# EAGLE schematic elasticNode (EAGLE 9.4.2)

## Sheet 1 of 4
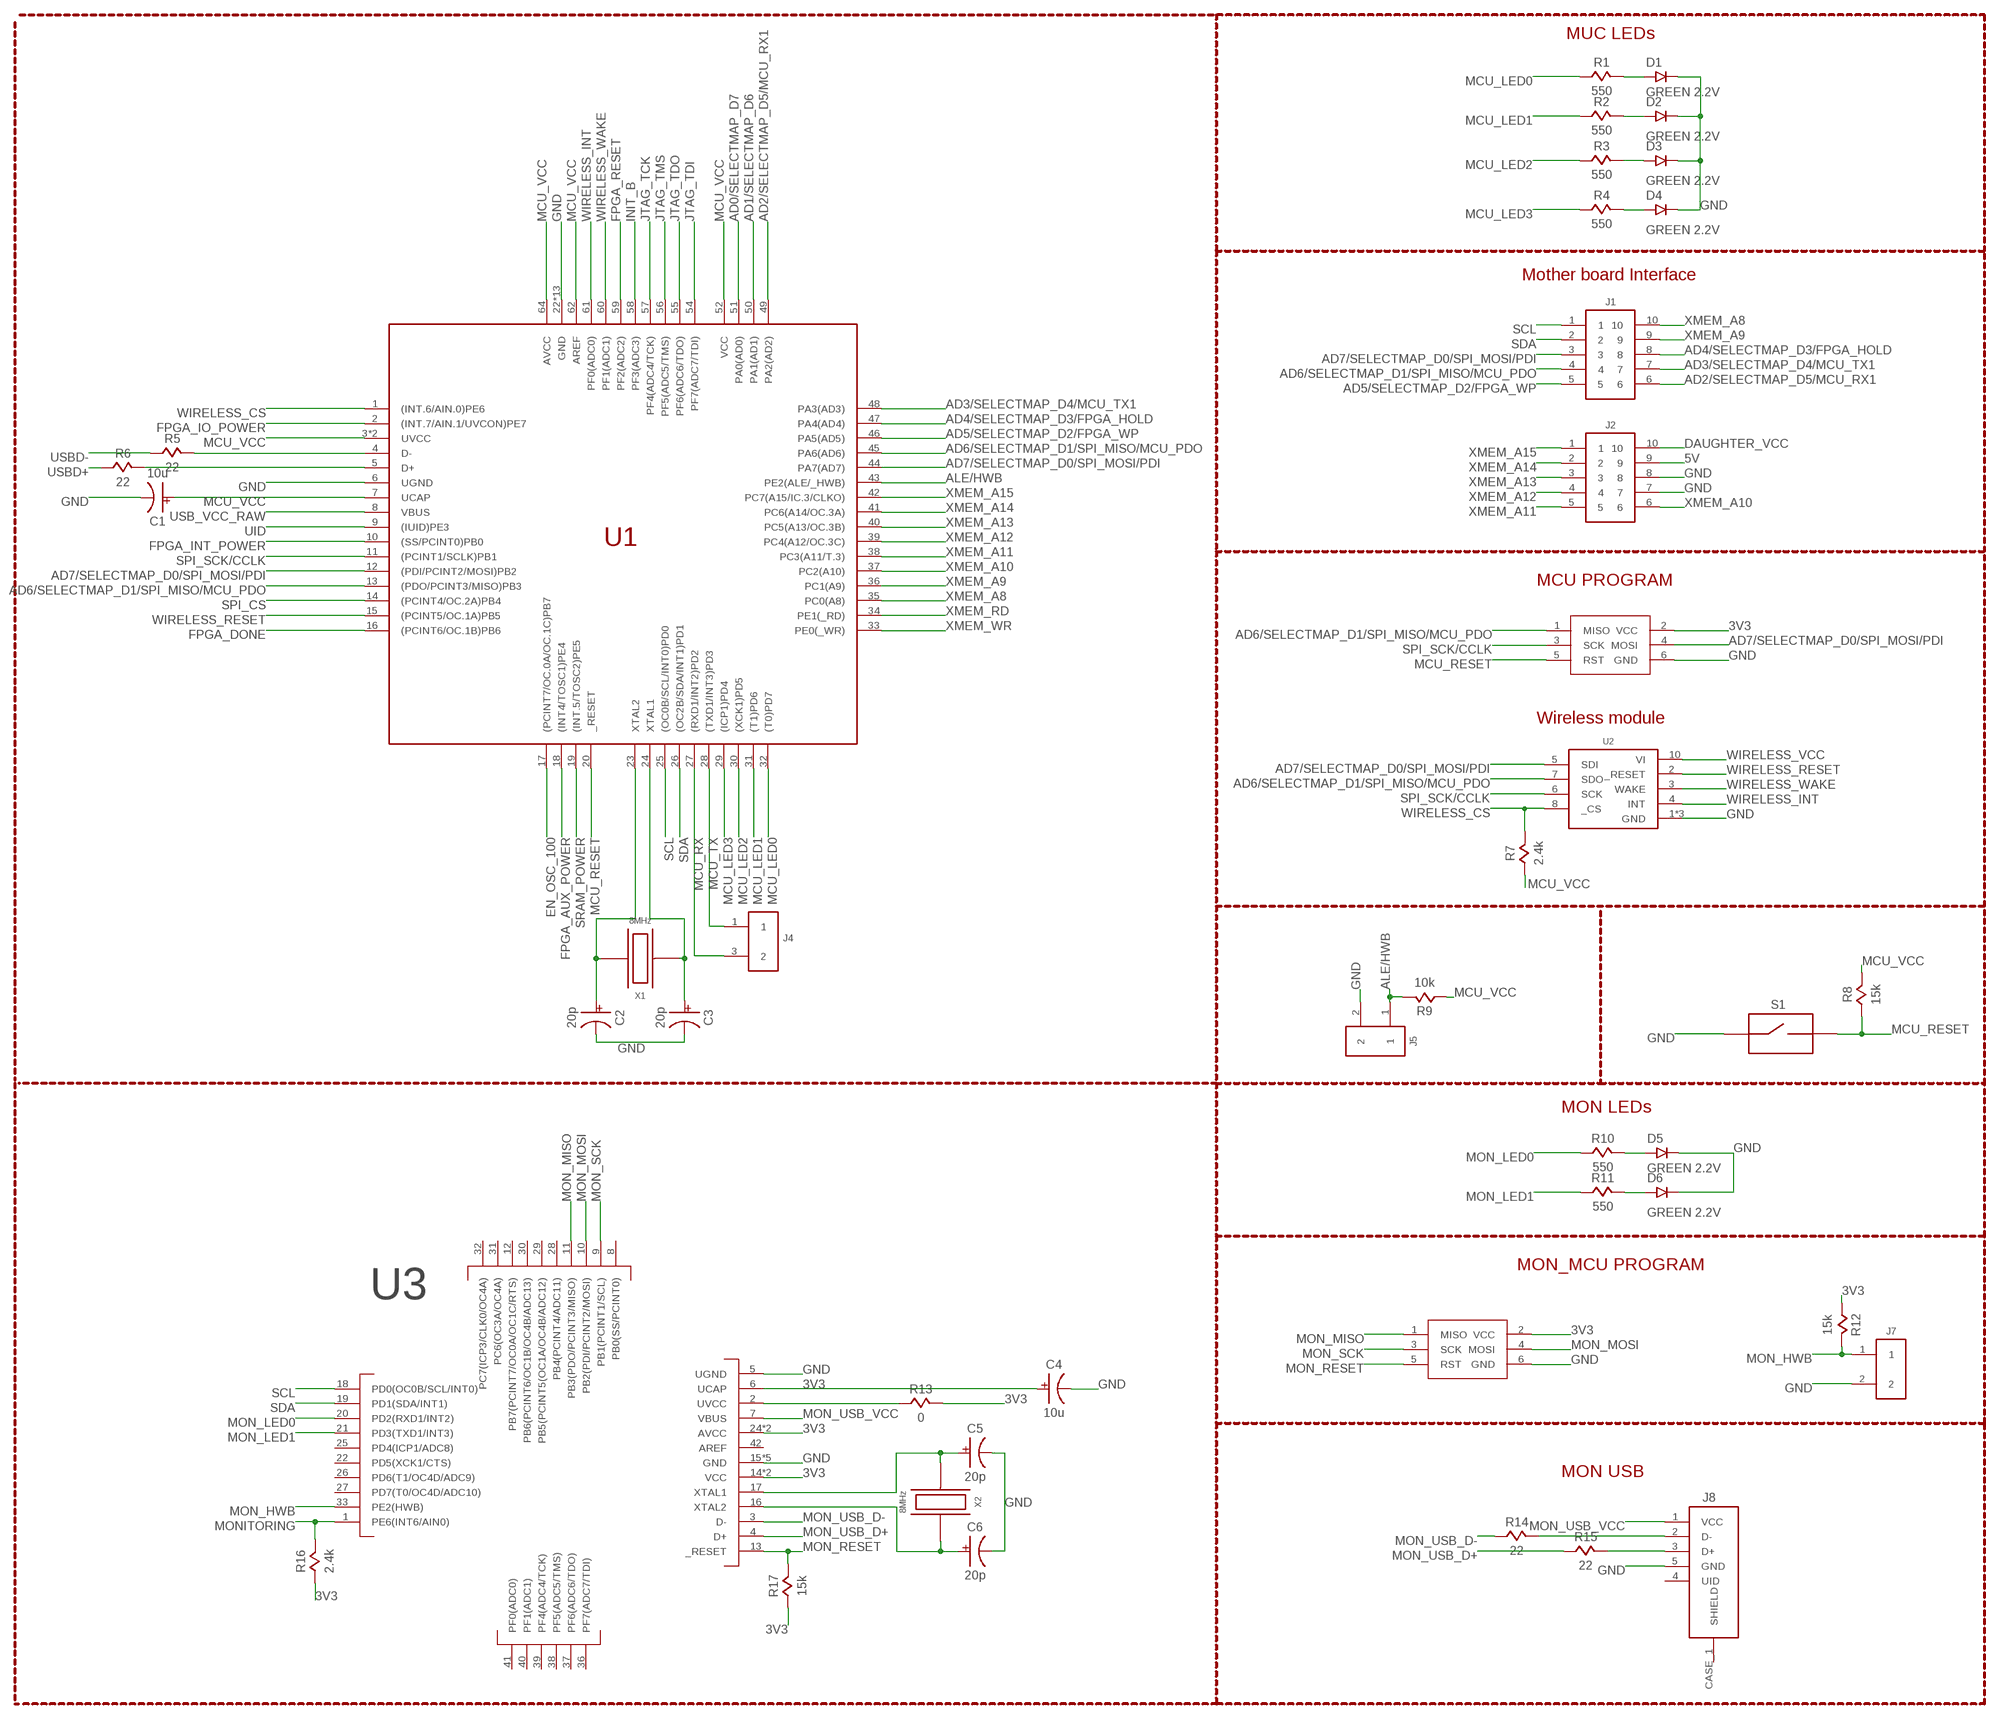
[diagram p0: schematic, sheet 1]

### Parts
C1  10u  CAPACITOR0805  [0805]
C2  20p  CAPACITOR0805  [0805]
C3  20p  CAPACITOR0805  [0805]
C4  10u  CAPACITOR0805  [0805]
C5  20p  CAPACITOR0805  [0805]
C6  20p  CAPACITOR0805  [0805]
D1  GREEN 2.2V  LED  [0805]
D2  GREEN 2.2V  LED  [0805]
D3  GREEN 2.2V  LED  [0805]
D4  GREEN 2.2V  LED  [0805]
D5  GREEN 2.2V  LED  [0805]
D6  GREEN 2.2V  LED  [0805]
J1  FEMALE_HEADER_5X2  [5X2_HEADER_SMT_1.27]
J2  FEMALE_HEADER_5X2  [5X2_HEADER_SMT_1.27]
J3  ISP_CONN_6PIN  [ICSP_SMT]
J4  FEMALE_HEADER_2X1  [2X1_HEADER]
J5  JUMPER  [JUMPER_SMT]
J6  ISP_CONN_6PIN  [ICSP_SMT]
J7  JUMPER  [JUMPER_SMT]
J8  USB_CONNMICRO_SMT  [USB_MICRO_B_SMT]
R1  550  RESISTOR  [0805]
R2  550  RESISTOR  [0805]
R3  550  RESISTOR  [0805]
R4  550  RESISTOR  [0805]
R5  22  RESISTOR  [0805]
R6  22  RESISTOR  [0805]
R7  2.4k  RESISTOR  [0805]
R8  15k  RESISTOR  [0805]
R9  10k  RESISTOR  [0805]
R10  550  RESISTOR  [0805]
R11  550  RESISTOR  [0805]
R12  15k  RESISTOR  [0805]
R13  0  RESISTOR  [0805]
R14  22  RESISTOR  [0805]
R15  22  RESISTOR  [0805]
R16  2.4k  RESISTOR  [0805]
R17  15k  RESISTOR  [0805]
S1  SPST_BUTTON2PIN_SMT  [SPST_2PIN_SMT]
U1  AT90USB128  [QFN64]
U2  MRF24J40MA  [MRF24J40MA]
U3  ATMEGA32U4QFN  [QFN44]
X1  8MHz  QUARTZ  [3.2X2.5_OSC]
X2  8MHz  QUARTZ  [3.2X2.5_OSC]

### Nets
3V3 [power]: C4.1 J3.2(VCC) J6.2(VCC) R12.1 R13.2 R16.1 R17.1 U3.6(UCAP) U3.14(VCC) U3.24(AVCC) U3.34(VCC) U3.44(AVCC) ; also sheet 2,3,4
5V [power]: J2.9 ; also sheet 3,4
AD0/SELECTMAP_D7: U1.51(PA0(AD0)) ; also sheet 2
AD1/SELECTMAP_D6: U1.50(PA1(AD1)) ; also sheet 2
AD2/SELECTMAP_D5/MCU_RX1: J1.6 U1.49(PA2(AD2)) ; also sheet 2
AD3/SELECTMAP_D4/MCU_TX1: J1.7 U1.48(PA3(AD3)) ; also sheet 2
AD4/SELECTMAP_D3/FPGA_HOLD: J1.8 U1.47(PA4(AD4)) ; also sheet 2
AD5/SELECTMAP_D2/FPGA_WP: J1.5 U1.46(PA5(AD5)) ; also sheet 2
AD6/SELECTMAP_D1/SPI_MISO/MCU_PDO: J1.4 J3.1(MISO) U1.13((PDO/PCINT3/MISO)PB3) U1.45(PA6(AD6)) U2.7(SDO) ; also sheet 2
AD7/SELECTMAP_D0/SPI_MOSI/PDI: J1.3 J3.4(MOSI) U1.12((PDI/PCINT2/MOSI)PB2) U1.44(PA7(AD7)) U2.5(SDI) ; also sheet 2
ALE/HWB: J5.1 R9.2 U1.43(PE2(ALE/_HWB)) ; also sheet 2
DAUGHTER_VCC [power]: J2.10 ; also sheet 3
EN_OSC_100 [power]: U1.17((PCINT7/OC.0A/OC.1C)PB7) ; also sheet 2
FPGA_AUX_POWER: U1.18((INT4/TOSC1)PE4) ; also sheet 2
FPGA_DONE: U1.16((PCINT6/OC.1B)PB6) ; also sheet 2
FPGA_INT_POWER: U1.10((SS/PCINT0)PB0) ; also sheet 2
FPGA_IO_POWER: U1.2((INT.7/AIN.1/UVCON)PE7) ; also sheet 2
FPGA_RESET: U1.59(PF2(ADC2)) ; also sheet 2
GND: C1.2 C2.2 C3.2 C4.2 C5.2 C6.2 D1.2 D2.2 D3.2 D4.2 D5.2 D6.2 J2.7 J2.8 J3.6(GND) J5.2 J6.6(GND) J7.2 J8.5(GND) S1.1 U1.6(UGND) U1.22(GND) U1.53(GND) U1.63(GND) U1.PAD(GND) U1.VIA1(GND) U1.VIA2(GND) U1.VIA3(GND) U1.VIA4(GND) U1.VIA5(GND) U1.VIA6(GND) U1.VIA7(GND) U1.VIA8(GND) U1.VIA9(GND) U2.1(GND) U2.11(GND) U2.12(GND) U3.5(UGND) U3.15(GND) U3.23(GND) U3.35(GND) U3.43(GND) U3.45(GND) ; also sheet 2,3,4
INIT_B: U1.58(PF3(ADC3)) ; also sheet 2
JTAG_TCK: U1.57(PF4(ADC4/TCK)) ; also sheet 2
JTAG_TDI: U1.54(PF7(ADC7/TDI)) ; also sheet 2
JTAG_TDO: U1.55(PF6(ADC6/TDO)) ; also sheet 2
JTAG_TMS: U1.56(PF5(ADC5/TMS)) ; also sheet 2
MCU_LED0: R1.1 U1.32((T0)PD7)
MCU_LED1: R2.1 U1.31((T1)PD6)
MCU_LED2: R3.1 U1.30((XCK1)PD5)
MCU_LED3: R4.1 U1.29((ICP1)PD4)
MCU_RESET: J3.5(RST) R8.1 S1.2 U1.20(_RESET)
MCU_RX: J4.3 U1.27((RXD1/INT2)PD2)
MCU_TX: J4.1 U1.28((TXD1/INT3)PD3)
MCU_VCC [power]: C1.1 R7.1 R8.2 R9.1 U1.3(UVCC) U1.7(UCAP) U1.21(UVCC) U1.52(VCC) U1.62(AREF) U1.64(AVCC) ; also sheet 3
MON_HWB: J7.1 R12.2 U3.33(PE2(HWB))
MON_LED0: R10.1 U3.20(PD2(RXD1/INT2))
MON_LED1: R11.1 U3.21(PD3(TXD1/INT3))
MON_MISO: J6.1(MISO) U3.11(PB3(PDO/PCINT3/MISO))
MON_MOSI: J6.4(MOSI) U3.10(PB2(PDI/PCINT2/MOSI))
MON_RESET: J6.5(RST) R17.2 U3.13(_RESET)
MON_SCK: J6.3(SCK) U3.9(PB1(PCINT1/SCL))
MON_USB_D+: R15.1 U3.4(D+)
MON_USB_D-: R14.1 U3.3(D-)
MON_USB_VCC [power]: J8.1(VCC) U3.7(VBUS)
MONITORING: R16.2 U3.1(PE6(INT6/AIN0)) ; also sheet 2
N$3: R5.2 U1.4(D-)
N$4: C2.1 U1.23(XTAL2) X1.1
N$5: J8.3(D+) R15.2
N$6: C3.1 U1.24(XTAL1) X1.3
N$10: R6.2 U1.5(D+)
N$13: D4.1 R4.2
N$15: D3.1 R3.2
N$16: D6.1 R11.2
N$17: D5.1 R10.2
N$18: C5.1 U3.17(XTAL1) X2.3
N$19: J8.2(D-) R14.2
N$20: C6.1 U3.16(XTAL2) X2.1
N$21: R13.1 U3.2(UVCC)
N$23: D2.1 R2.2
N$24: D1.1 R1.2
SCL: J1.1 U1.25((OC0B/SCL/INT0)PD0) U3.18(PD0(OC0B/SCL/INT0)) ; also sheet 3
SDA: J1.2 U1.26((OC2B/SDA/INT1)PD1) U3.19(PD1(SDA/INT1)) ; also sheet 3
SPI_CS: U1.14((PCINT4/OC.2A)PB4) ; also sheet 2
SPI_SCK/CCLK: J3.3(SCK) U1.11((PCINT1/SCLK)PB1) U2.6(SCK) ; also sheet 2
SRAM_POWER: U1.19((INT.5/TOSC2)PE5) ; also sheet 2
UID: U1.9((IUID)PE3) ; also sheet 4
USB_VCC_RAW [power]: U1.8(VBUS) ; also sheet 3,4
USBD+: R6.1 ; also sheet 4
USBD-: R5.1 ; also sheet 4
WIRELESS_CS: R7.2 U1.1((INT.6/AIN.0)PE6) U2.8(_CS)
WIRELESS_INT: U1.61(PF0(ADC0)) U2.4(INT)
WIRELESS_RESET: U1.15((PCINT5/OC.1A)PB5) U2.2(_RESET)
WIRELESS_VCC [power]: U2.10(VI) ; also sheet 3
WIRELESS_WAKE: U1.60(PF1(ADC1)) U2.3(WAKE)
XMEM_A8: J1.10 U1.35(PC0(A8)) ; also sheet 2
XMEM_A9: J1.9 U1.36(PC1(A9)) ; also sheet 2
XMEM_A10: J2.6 U1.37(PC2(A10)) ; also sheet 2
XMEM_A11: J2.5 U1.38(PC3(A11/T.3)) ; also sheet 2
XMEM_A12: J2.4 U1.39(PC4(A12/OC.3C)) ; also sheet 2
XMEM_A13: J2.3 U1.40(PC5(A13/OC.3B)) ; also sheet 2
XMEM_A14: J2.2 U1.41(PC6(A14/OC.3A)) ; also sheet 2
XMEM_A15: J2.1 U1.42(PC7(A15/IC.3/CLKO)) ; also sheet 2
XMEM_RD: U1.34(PE1(_RD)) ; also sheet 2
XMEM_WR: U1.33(PE0(_WR)) ; also sheet 2
Unconnected: J8.4(UID) J8.CASE_1(SHIELD) U3.8(PB0(SS/PCINT0)) U3.12(PB7(PCINT7/OC0A/OC1C/RTS)) U3.22(PD5(XCK1/CTS)) U3.25(PD4(ICP1/ADC8)) U3.26(PD6(T1/OC4D/ADC9)) U3.27(PD7(T0/OC4D/ADC10)) U3.28(PB4(PCINT4/ADC11)) U3.29(PB5(PCINT5(OC1A/OC4B/ADC12)) U3.30(PB6(PCINT6/OC1B/OC4B/ADC13)) U3.31(PC6(OC3A/OC4A)) U3.32(PC7(ICP3/CLK0/OC4A)) U3.36(PF7(ADC7/TDI)) U3.37(PF6(ADC6/TDO)) U3.38(PF5(ADC5/TMS)) U3.39(PF4(ADC4/TCK)) U3.40(PF1(ADC1)) U3.41(PF0(ADC0)) U3.42(AREF)

### Notes on the sheet
- MUC LEDs
- Mother board Interface
- MCU PROGRAM
- Wireless module
- MON LEDs
- MON_MCU PROGRAM
- MON USB

## Sheet 2 of 4
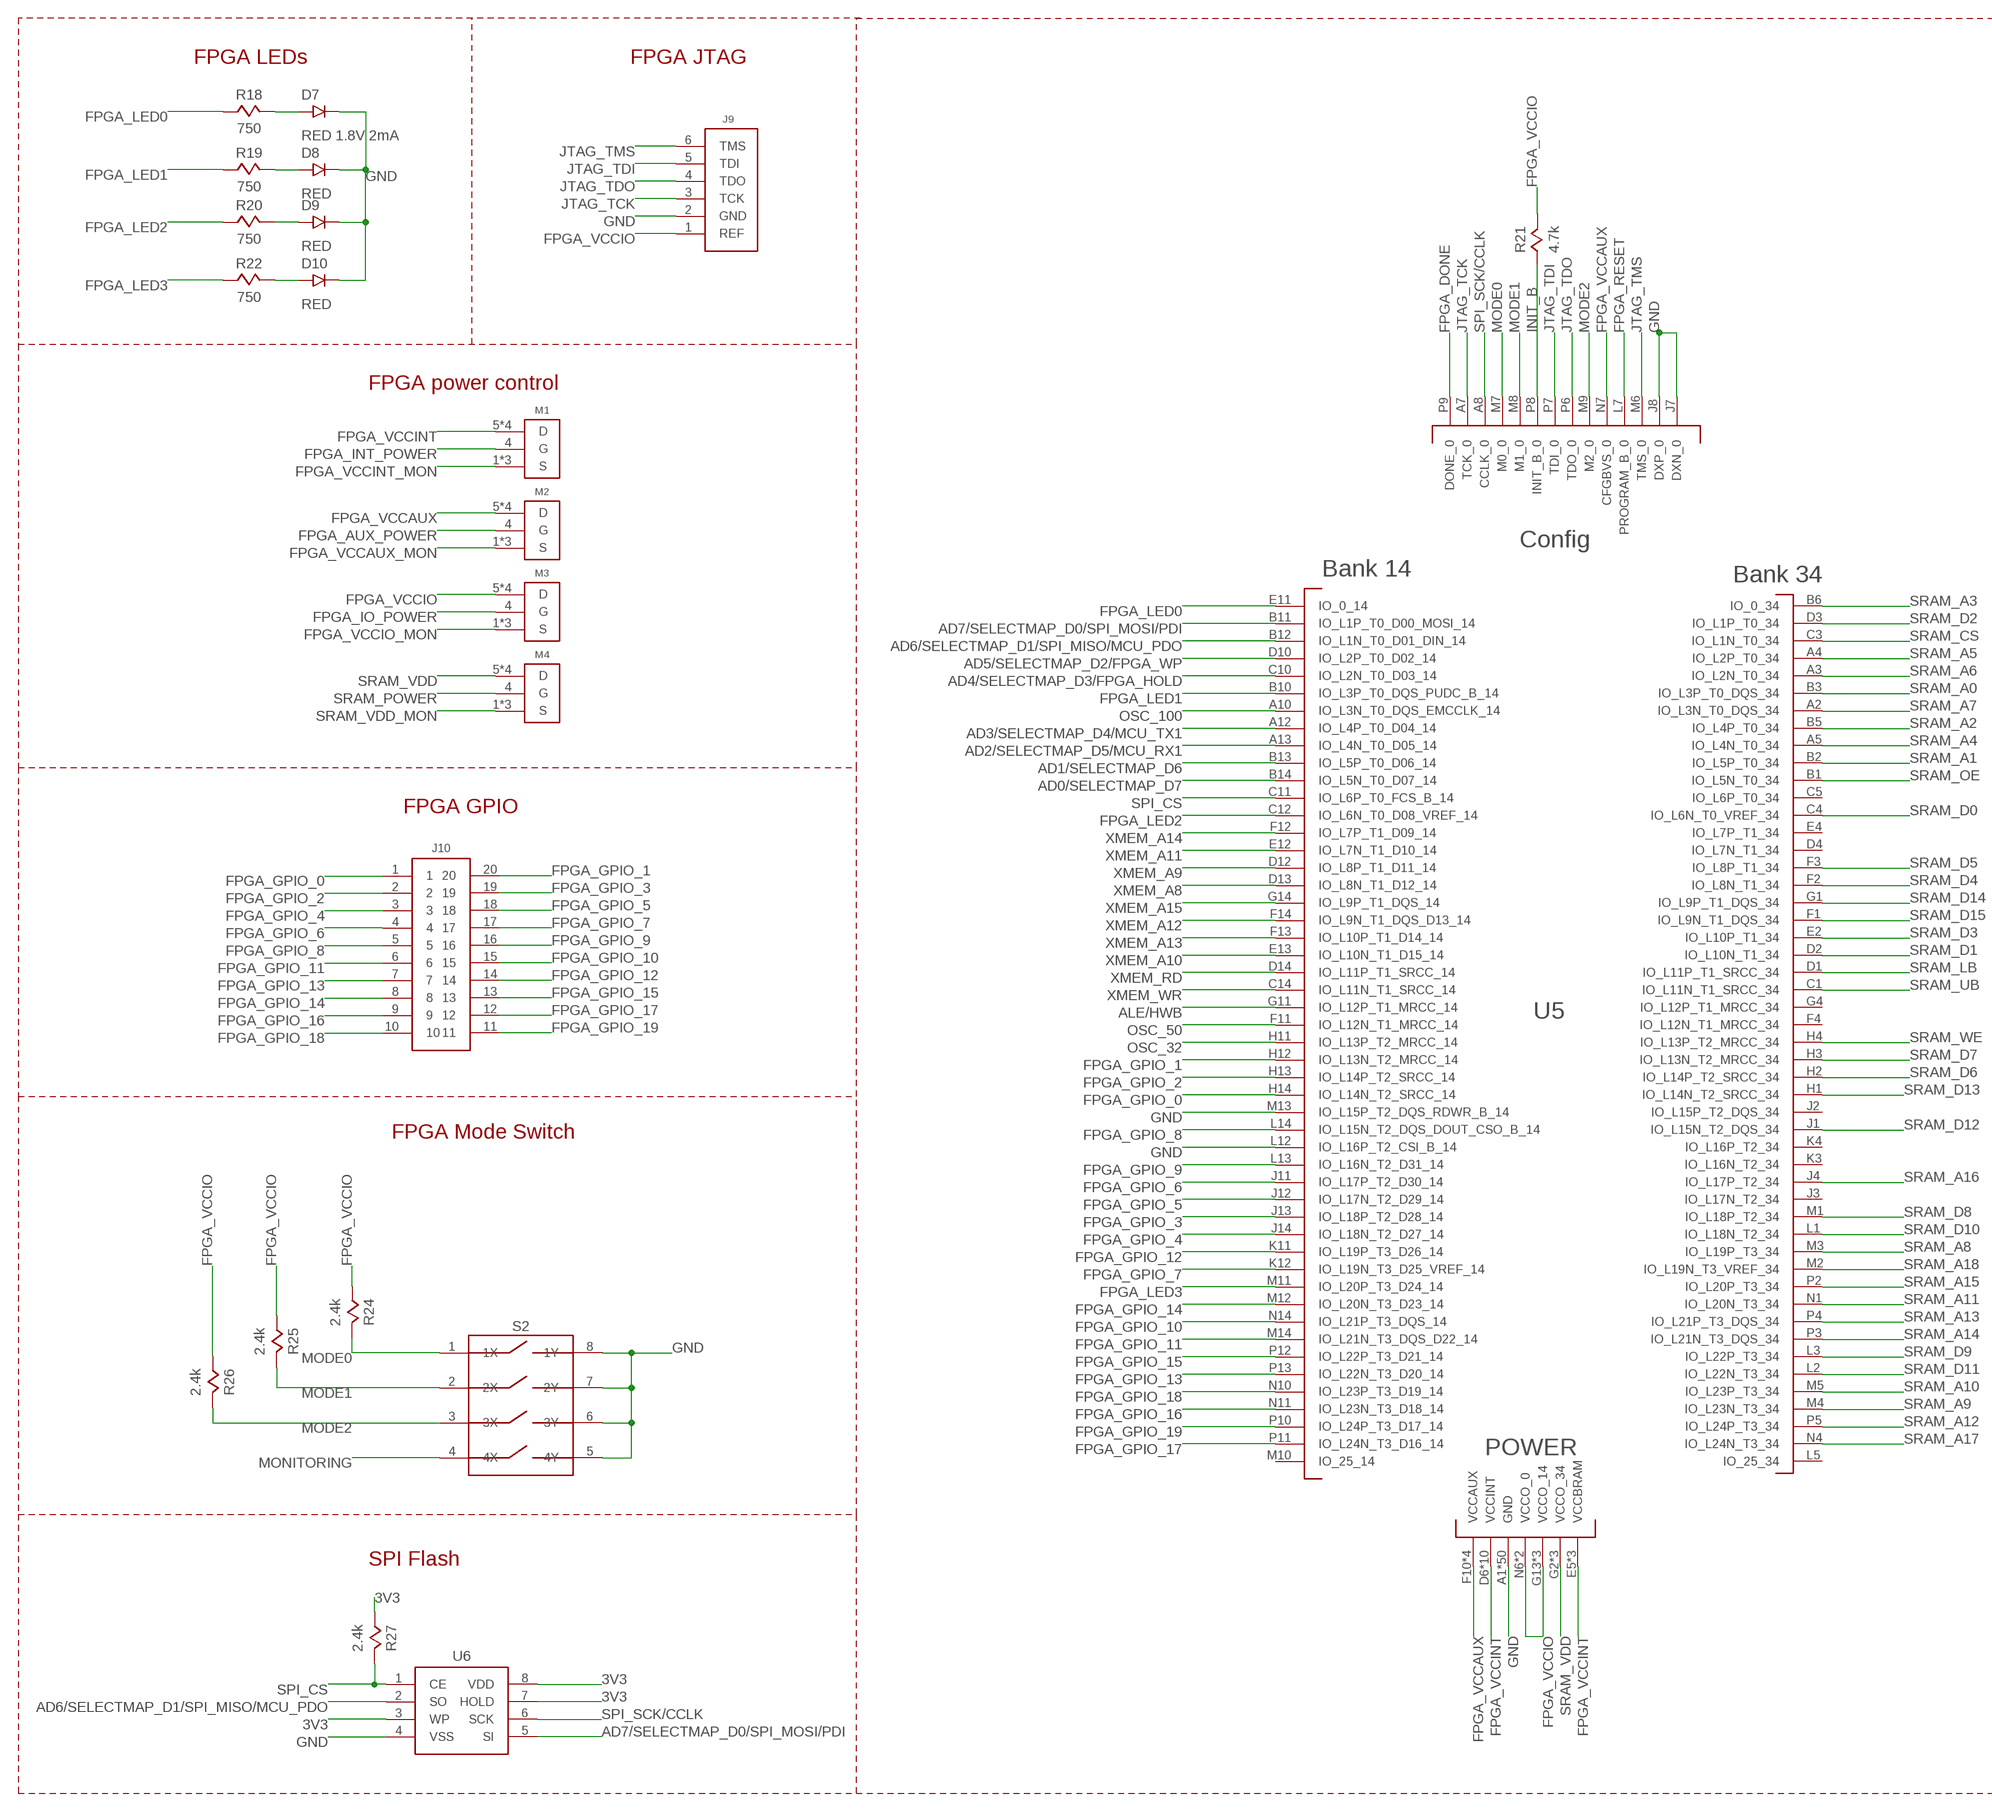
[diagram p1: schematic, sheet 2, part 1 of 2]
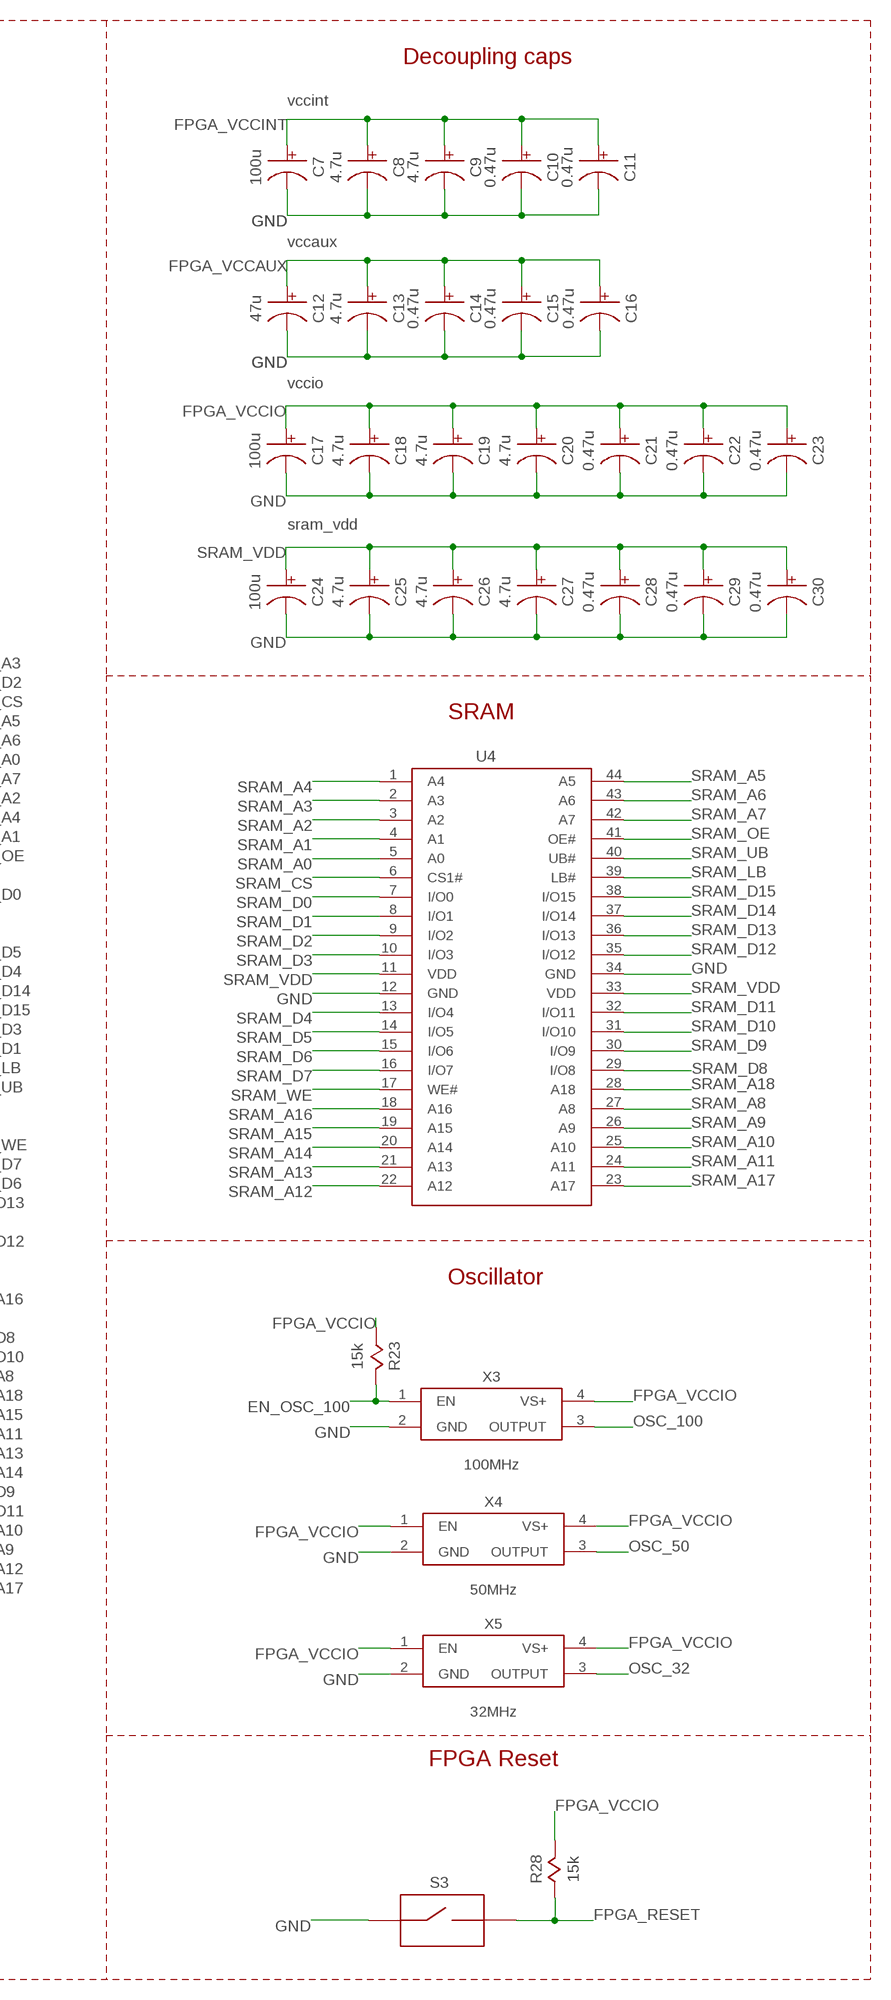
[diagram p2: schematic, sheet 2, part 2 of 2]

### Parts
C7  100u  CAPACITOR1210  [1210]
C8  4.7u  CAPACITOR0805  [0805]
C9  4.7u  CAPACITOR0805  [0805]
C10  0.47u  CAPACITOR0805  [0805]
C11  0.47u  CAPACITOR0805  [0805]
C12  47u  CAPACITOR1210  [1210]
C13  4.7u  CAPACITOR0805  [0805]
C14  0.47u  CAPACITOR0805  [0805]
C15  0.47u  CAPACITOR0805  [0805]
C16  0.47u  CAPACITOR0805  [0805]
C17  100u  CAPACITOR1210  [1210]
C18  4.7u  CAPACITOR0805  [0805]
C19  4.7u  CAPACITOR0805  [0805]
C20  4.7u  CAPACITOR0805  [0805]
C21  0.47u  CAPACITOR0805  [0805]
C22  0.47u  CAPACITOR0805  [0805]
C23  0.47u  CAPACITOR0805  [0805]
C24  100u  CAPACITOR1210  [1210]
C25  4.7u  CAPACITOR0805  [0805]
C26  4.7u  CAPACITOR0805  [0805]
C27  4.7u  CAPACITOR0805  [0805]
C28  0.47u  CAPACITOR0805  [0805]
C29  0.47u  CAPACITOR0805  [0805]
C30  0.47u  CAPACITOR0805  [0805]
D7  RED 1.8V 2mA  LED  [0805]
D8  RED  LED  [0805]
D9  RED  LED  [0805]
D10  RED  LED  [0805]
J9  JTAG_CONN_6PINSMT  [6X1_JTAG]
J10  FEMALE_HEADER_10X2  [10X2_HEADER_SMT]
M1  SISS23DN  [POWERPAK1212-8]
M2  SISS23DN  [POWERPAK1212-8]
M3  SISS23DN  [POWERPAK1212-8]
M4  SISS23DN  [POWERPAK1212-8]
R18  750  RESISTOR  [0805]
R19  750  RESISTOR  [0805]
R20  750  RESISTOR  [0805]
R21  4.7k  RESISTOR  [0805]
R22  750  RESISTOR  [0805]
R23  15k  RESISTOR  [0805]
R24  2.4k  RESISTOR  [0805]
R25  2.4k  RESISTOR  [0805]
R26  2.4k  RESISTOR  [0805]
R27  2.4k  RESISTOR  [0805]
R28  15k  RESISTOR  [0805]
S2  SPST_DIP_4  [SPST_DIP4_SMT]
S3  SPST_BUTTON2PIN_SMT  [SPST_2PIN_SMT]
U4  IS66WV51216EALL  [TSOP44]
U5  SPARTAN7-LX15  [FTGB196]
U6  SST26VF032BWDFN  [WDFN8]
X3  100MHz  OSCILLATOR3.2X2.5  [3.2X2.5_OSC]
X4  50MHz  OSCILLATOR3.2X2.5  [3.2X2.5_OSC]
X5  32MHz  OSCILLATOR3.2X2.5  [3.2X2.5_OSC]

### Nets
3V3 [power]: R27.1 U6.3(WP) U6.7(HOLD) U6.8(VDD) ; also sheet 1,3,4
AD0/SELECTMAP_D7: U5.B14(IO_L5N_T0_D07_14) ; also sheet 1
AD1/SELECTMAP_D6: U5.B13(IO_L5P_T0_D06_14) ; also sheet 1
AD2/SELECTMAP_D5/MCU_RX1: U5.A13(IO_L4N_T0_D05_14) ; also sheet 1
AD3/SELECTMAP_D4/MCU_TX1: U5.A12(IO_L4P_T0_D04_14) ; also sheet 1
AD4/SELECTMAP_D3/FPGA_HOLD: U5.C10(IO_L2N_T0_D03_14) ; also sheet 1
AD5/SELECTMAP_D2/FPGA_WP: U5.D10(IO_L2P_T0_D02_14) ; also sheet 1
AD6/SELECTMAP_D1/SPI_MISO/MCU_PDO: U5.B12(IO_L1N_T0_D01_DIN_14) U6.2(SO) ; also sheet 1
AD7/SELECTMAP_D0/SPI_MOSI/PDI: U5.B11(IO_L1P_T0_D00_MOSI_14) U6.5(SI) ; also sheet 1
ALE/HWB: U5.G11(IO_L12P_T1_MRCC_14) ; also sheet 1
EN_OSC_100 [power]: R23.1 X3.1(EN) ; also sheet 1
FPGA_AUX_POWER: M2.4(G) ; also sheet 1
FPGA_DONE: U5.P9(DONE_0) ; also sheet 1
FPGA_GPIO_0: J10.1 U5.H14(IO_L14N_T2_SRCC_14)
FPGA_GPIO_1: J10.20 U5.H12(IO_L13N_T2_MRCC_14)
FPGA_GPIO_2: J10.2 U5.H13(IO_L14P_T2_SRCC_14)
FPGA_GPIO_3: J10.19 U5.J13(IO_L18P_T2_D28_14)
FPGA_GPIO_4: J10.3 U5.J14(IO_L18N_T2_D27_14)
FPGA_GPIO_5: J10.18 U5.J12(IO_L17N_T2_D29_14)
FPGA_GPIO_6: J10.4 U5.J11(IO_L17P_T2_D30_14)
FPGA_GPIO_7: J10.17 U5.K12(IO_L19N_T3_D25_VREF_14)
FPGA_GPIO_8: J10.5 U5.L14(IO_L15N_T2_DQS_DOUT_CSO_B_14)
FPGA_GPIO_9: J10.16 U5.L13(IO_L16N_T2_D31_14)
FPGA_GPIO_10: J10.15 U5.N14(IO_L21P_T3_DQS_14)
FPGA_GPIO_11: J10.6 U5.M14(IO_L21N_T3_DQS_D22_14)
FPGA_GPIO_12: J10.14 U5.K11(IO_L19P_T3_D26_14)
FPGA_GPIO_13: J10.7 U5.P13(IO_L22N_T3_D20_14)
FPGA_GPIO_14: J10.8 U5.M12(IO_L20N_T3_D23_14)
FPGA_GPIO_15: J10.13 U5.P12(IO_L22P_T3_D21_14)
FPGA_GPIO_16: J10.9 U5.N11(IO_L23N_T3_D18_14)
FPGA_GPIO_17: J10.12 U5.P11(IO_L24N_T3_D16_14)
FPGA_GPIO_18: J10.10 U5.N10(IO_L23P_T3_D19_14)
FPGA_GPIO_19: J10.11 U5.P10(IO_L24P_T3_D17_14)
FPGA_INT_POWER: M1.4(G) ; also sheet 1
FPGA_IO_POWER: M3.4(G) ; also sheet 1
FPGA_LED0: R18.1 U5.E11(IO_0_14)
FPGA_LED1: R19.1 U5.B10(IO_L3P_T0_DQS_PUDC_B_14)
FPGA_LED2: R20.1 U5.C12(IO_L6N_T0_D08_VREF_14)
FPGA_LED3: R22.1 U5.M11(IO_L20P_T3_D24_14)
FPGA_RESET: R28.1 S3.2 U5.L7(PROGRAM_B_0) ; also sheet 1
FPGA_VCCAUX [power]: C12.1 C13.1 C14.1 C15.1 C16.1 M2.5(D) M2.6(D) M2.7(D) M2.8(D) U5.F10(VCCAUX) U5.H10(VCCAUX) U5.K10(VCCAUX) U5.L9(VCCAUX) U5.N7(CFGBVS_0)
FPGA_VCCAUX_MON [power]: M2.1(S) M2.2(S) M2.3(S) ; also sheet 3
FPGA_VCCINT [power]: C7.1 C8.1 C9.1 C10.1 C11.1 M1.5(D) M1.6(D) M1.7(D) M1.8(D) U5.D6(VCCINT) U5.D8(VCCINT) U5.E5(VCCBRAM) U5.E7(VCCINT) U5.E9(VCCINT) U5.F6(VCCINT) U5.G5(VCCBRAM) U5.G9(VCCINT) U5.H6(VCCINT) U5.J5(VCCBRAM) U5.J9(VCCINT) U5.K6(VCCINT) U5.K8(VCCINT)
FPGA_VCCINT_MON [power]: M1.1(S) M1.2(S) M1.3(S) ; also sheet 3
FPGA_VCCIO [power]: C17.1 C18.1 C19.1 C20.1 C21.1 C22.1 C23.1 J9.1(REF) M3.5(D) M3.6(D) M3.7(D) M3.8(D) R21.2 R23.2 R24.1 R25.1 R26.1 R28.2 U5.G13(VCCO_14) U5.K13(VCCO_14) U5.N6(VCCO_0) U5.N8(VCCO_0) U5.N13(VCCO_14) X3.4(VS+) X4.1(EN) X4.4(VS+) X5.1(EN) X5.4(VS+)
FPGA_VCCIO_MON [power]: M3.1(S) M3.2(S) M3.3(S) ; also sheet 3
GND: C7.2 C8.2 C9.2 C10.2 C11.2 C12.2 C13.2 C14.2 C15.2 C16.2 C17.2 C18.2 C19.2 C20.2 C21.2 C22.2 C23.2 C24.2 C25.2 C26.2 C27.2 C28.2 C29.2 C30.2 D7.2 D8.2 D9.2 D10.2 J9.2(GND) S2.5(4Y) S2.6(3Y) S2.7(2Y) S2.8(1Y) S3.1 U4.12(GND) U4.34(GND) U5.A1(GND) U5.A6(GND) U5.A9(GND) U5.A11(GND) U5.A14(GND) U5.B4(GND) U5.B7(GND) U5.B9(GND) U5.C2(GND) U5.C6(GND) U5.C7(GND) U5.C8(GND) U5.C9(GND) U5.C13(GND) U5.D5(GND) U5.D7(GND) U5.D9(GND) U5.D11(GND) U5.E1(GND) U5.E3(GND) U5.E6(GND) U5.E8(GND) U5.E10(GND) U5.E14(GND) U5.F5(GND) U5.F9(GND) U5.G3(GND) U5.G6(GND) U5.G10(GND) U5.G12(GND) U5.H5(GND) U5.H9(GND) U5.J6(GND) U5.J7(DXN_0) U5.J8(DXP_0) U5.J10(GND) U5.K1(GND) U5.K5(GND) U5.K7(GND) U5.K9(GND) U5.K14(GND) U5.L4(GND) U5.L6(GND) U5.L8(GND) U5.L10(GND) U5.L11(GND) U5.L12(IO_L16P_T2_CSI_B_14) U5.M13(IO_L15P_T2_DQS_RDWR_B_14) U5.N3(GND) U5.N5(GND) U5.N9(GND) U5.N12(GND) U5.P1(GND) U5.P14(GND) U6.4(VSS) X3.2(GND) X4.2(GND) X5.2(GND) ; also sheet 1,3,4
INIT_B: R21.1 U5.P8(INIT_B_0) ; also sheet 1
JTAG_TCK: J9.3(TCK) U5.A7(TCK_0) ; also sheet 1
JTAG_TDI: J9.5(TDI) U5.P7(TDI_0) ; also sheet 1
JTAG_TDO: J9.4(TDO) U5.P6(TDO_0) ; also sheet 1
JTAG_TMS: J9.6(TMS) U5.M6(TMS_0) ; also sheet 1
MODE0: R24.2 S2.1(1X) U5.M7(M0_0)
MODE1: R25.2 S2.2(2X) U5.M8(M1_0)
MODE2: R26.2 S2.3(3X) U5.M9(M2_0)
MONITORING: S2.4(4X) ; also sheet 1
N$25: D10.1 R22.2
N$27: D9.1 R20.2
N$29: D8.1 R19.2
N$30: D7.1 R18.2
OSC_32: U5.H11(IO_L13P_T2_MRCC_14) X5.3(OUTPUT)
OSC_50: U5.F11(IO_L12N_T1_MRCC_14) X4.3(OUTPUT)
OSC_100: U5.A10(IO_L3N_T0_DQS_EMCCLK_14) X3.3(OUTPUT)
SPI_CS: R27.2 U5.C11(IO_L6P_T0_FCS_B_14) U6.1(CE) ; also sheet 1
SPI_SCK/CCLK: U5.A8(CCLK_0) U6.6(SCK) ; also sheet 1
SRAM_A0: U4.5(A0) U5.B3(IO_L3P_T0_DQS_34)
SRAM_A1: U4.4(A1) U5.B2(IO_L5P_T0_34)
SRAM_A2: U4.3(A2) U5.B5(IO_L4P_T0_34)
SRAM_A3: U4.2(A3) U5.B6(IO_0_34)
SRAM_A4: U4.1(A4) U5.A5(IO_L4N_T0_34)
SRAM_A5: U4.44(A5) U5.A4(IO_L2P_T0_34)
SRAM_A6: U4.43(A6) U5.A3(IO_L2N_T0_34)
SRAM_A7: U4.42(A7) U5.A2(IO_L3N_T0_DQS_34)
SRAM_A8: U4.27(A8) U5.M3(IO_L19P_T3_34)
SRAM_A9: U4.26(A9) U5.M4(IO_L23N_T3_34)
SRAM_A10: U4.25(A10) U5.M5(IO_L23P_T3_34)
SRAM_A11: U4.24(A11) U5.N1(IO_L20N_T3_34)
SRAM_A12: U4.22(A12) U5.P5(IO_L24P_T3_34)
SRAM_A13: U4.21(A13) U5.P4(IO_L21P_T3_DQS_34)
SRAM_A14: U4.20(A14) U5.P3(IO_L21N_T3_DQS_34)
SRAM_A15: U4.19(A15) U5.P2(IO_L20P_T3_34)
SRAM_A16: U4.18(A16) U5.J4(IO_L17P_T2_34)
SRAM_A17: U4.23(A17) U5.N4(IO_L24N_T3_34)
SRAM_A18: U4.28(A18) U5.M2(IO_L19N_T3_VREF_34)
SRAM_CS: U4.6(CS1#) U5.C3(IO_L1N_T0_34)
SRAM_D0: U4.7(I/O0) U5.C4(IO_L6N_T0_VREF_34)
SRAM_D1: U4.8(I/O1) U5.D2(IO_L10N_T1_34)
SRAM_D2: U4.9(I/O2) U5.D3(IO_L1P_T0_34)
SRAM_D3: U4.10(I/O3) U5.E2(IO_L10P_T1_34)
SRAM_D4: U4.13(I/O4) U5.F2(IO_L8N_T1_34)
SRAM_D5: U4.14(I/O5) U5.F3(IO_L8P_T1_34)
SRAM_D6: U4.15(I/O6) U5.H2(IO_L14P_T2_SRCC_34)
SRAM_D7: U4.16(I/O7) U5.H3(IO_L13N_T2_MRCC_34)
SRAM_D8: U4.29(I/O8) U5.M1(IO_L18P_T2_34)
SRAM_D9: U4.30(I/O9) U5.L3(IO_L22P_T3_34)
SRAM_D10: U4.31(I/O10) U5.L1(IO_L18N_T2_34)
SRAM_D11: U4.32(I/O11) U5.L2(IO_L22N_T3_34)
SRAM_D12: U4.35(I/O12) U5.J1(IO_L15N_T2_DQS_34)
SRAM_D13: U4.36(I/O13) U5.H1(IO_L14N_T2_SRCC_34)
SRAM_D14: U4.37(I/O14) U5.G1(IO_L9P_T1_DQS_34)
SRAM_D15: U4.38(I/O15) U5.F1(IO_L9N_T1_DQS_34)
SRAM_LB: U4.39(LB#) U5.D1(IO_L11P_T1_SRCC_34)
SRAM_OE: U4.41(OE#) U5.B1(IO_L5N_T0_34)
SRAM_POWER: M4.4(G) ; also sheet 1
SRAM_UB: U4.40(UB#) U5.C1(IO_L11N_T1_SRCC_34)
SRAM_VDD: C24.1 C25.1 C26.1 C27.1 C28.1 C29.1 C30.1 M4.5(D) M4.6(D) M4.7(D) M4.8(D) U4.11(VDD) U4.33(VDD) U5.G2(VCCO_34) U5.K2(VCCO_34) U5.N2(VCCO_34)
SRAM_VDD_MON: M4.1(S) M4.2(S) M4.3(S) ; also sheet 3
SRAM_WE: U4.17(WE#) U5.H4(IO_L13P_T2_MRCC_34)
XMEM_A8: U5.D13(IO_L8N_T1_D12_14) ; also sheet 1
XMEM_A9: U5.D12(IO_L8P_T1_D11_14) ; also sheet 1
XMEM_A10: U5.E13(IO_L10N_T1_D15_14) ; also sheet 1
XMEM_A11: U5.E12(IO_L7N_T1_D10_14) ; also sheet 1
XMEM_A12: U5.F14(IO_L9N_T1_DQS_D13_14) ; also sheet 1
XMEM_A13: U5.F13(IO_L10P_T1_D14_14) ; also sheet 1
XMEM_A14: U5.F12(IO_L7P_T1_D09_14) ; also sheet 1
XMEM_A15: U5.G14(IO_L9P_T1_DQS_14) ; also sheet 1
XMEM_RD: U5.D14(IO_L11P_T1_SRCC_14) ; also sheet 1
XMEM_WR: U5.C14(IO_L11N_T1_SRCC_14) ; also sheet 1
Unconnected: U5.C5(IO_L6P_T0_34) U5.D4(IO_L7N_T1_34) U5.E4(IO_L7P_T1_34) U5.F4(IO_L12N_T1_MRCC_34) U5.G4(IO_L12P_T1_MRCC_34) U5.J2(IO_L15P_T2_DQS_34) U5.J3(IO_L17N_T2_34) U5.K3(IO_L16N_T2_34) U5.K4(IO_L16P_T2_34) U5.L5(IO_25_34) U5.M10(IO_25_14)

### Notes on the sheet
- FPGA LEDs | FPGA JTAG | Decoupling caps
- vccint
- vccaux
- vccio
- FPGA power control
- sram_vdd
- SRAM
- FPGA GPIO
- FPGA Mode Switch
- Oscillator
- SPI Flash
- FPGA Reset

## Sheet 3 of 4
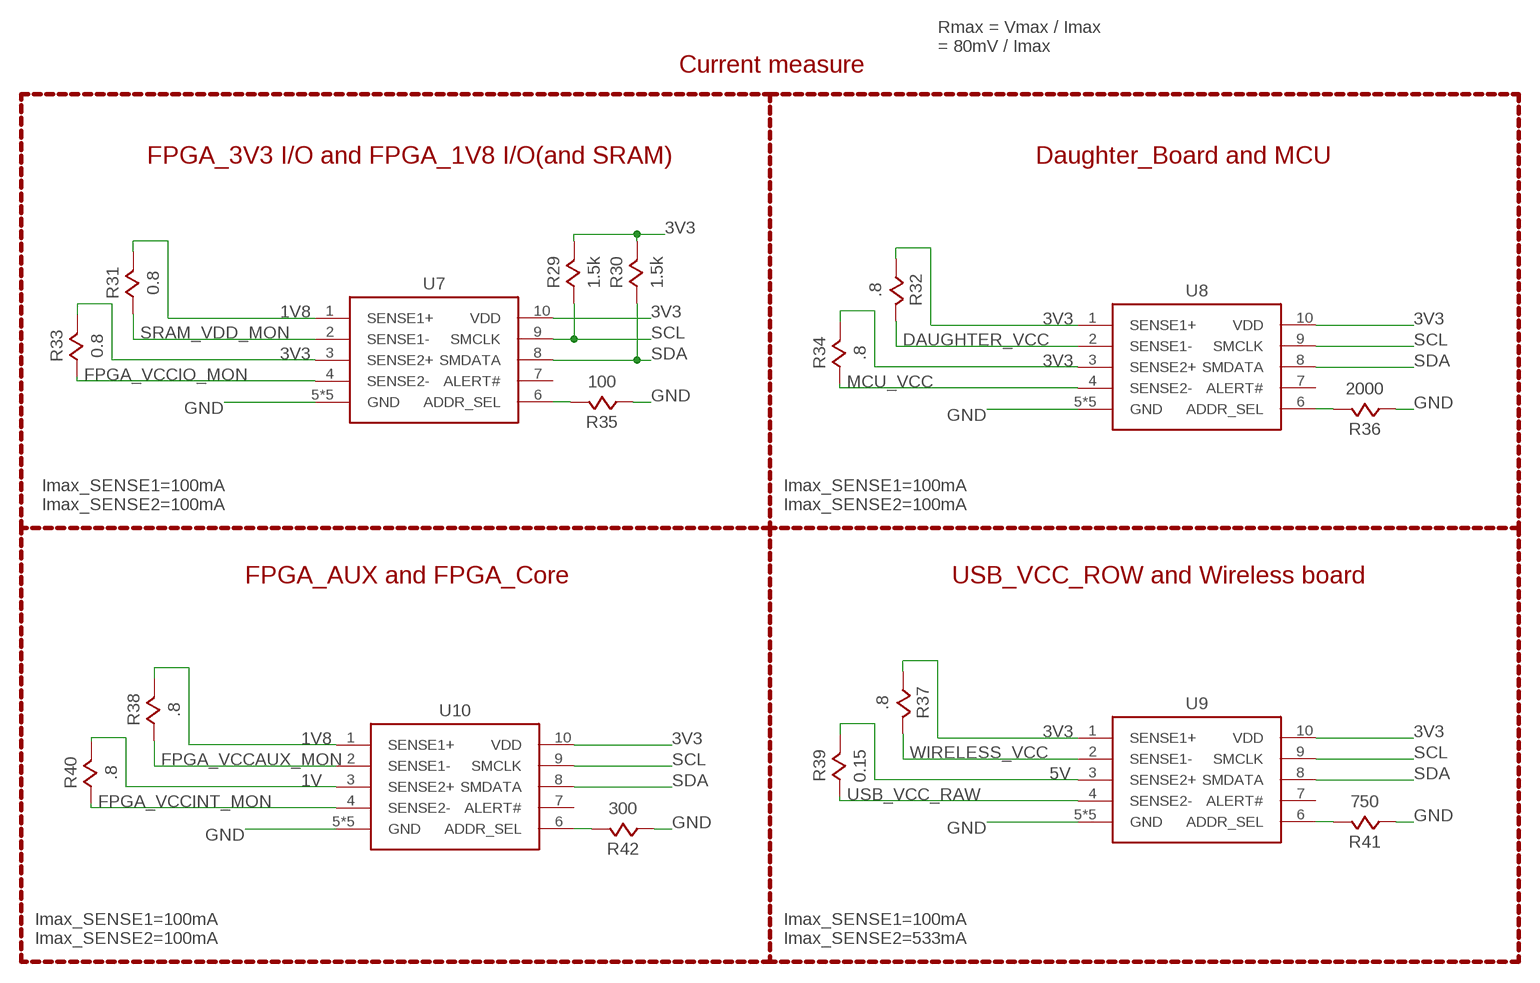
[diagram p3: schematic, sheet 3]

### Parts
R29  1.5k  RESISTOR  [0805]
R30  1.5k  RESISTOR  [0805]
R31  0.8  RESISTOR  [0805]
R32  .8  RESISTOR  [0805]
R33  0.8  RESISTOR  [0805]
R34  .8  RESISTOR  [0805]
R35  100  RESISTOR  [0805]
R36  2000  RESISTOR  [0805]
R37  .8  RESISTOR  [0805]
R38  .8  RESISTOR  [0805]
R39  0.15  RESISTOR  [0805]
R40  .8  RESISTOR  [0805]
R41  750  RESISTOR  [0805]
R42  300  RESISTOR  [0805]
U7  PAC1720  [VDFN10]
U8  PAC1720  [VDFN10]
U9  PAC1720  [VDFN10]
U10  PAC1720  [VDFN10]

### Nets
1V [power]: R40.2 U10.3(SENSE2+) ; also sheet 4
1V8: R31.2 R38.2 U7.1(SENSE1+) U10.1(SENSE1+) ; also sheet 4
3V3 [power]: R29.2 R30.2 R32.2 R33.2 R34.2 R37.2 U7.3(SENSE2+) U7.10(VDD) U8.1(SENSE1+) U8.3(SENSE2+) U8.10(VDD) U9.1(SENSE1+) U9.10(VDD) U10.10(VDD) ; also sheet 1,2,4
5V [power]: R39.2 U9.3(SENSE2+) ; also sheet 1,4
DAUGHTER_VCC [power]: R32.1 U8.2(SENSE1-) ; also sheet 1
FPGA_VCCAUX_MON [power]: R38.1 U10.2(SENSE1-) ; also sheet 2
FPGA_VCCINT_MON [power]: R40.1 U10.4(SENSE2-) ; also sheet 2
FPGA_VCCIO_MON [power]: R33.1 U7.4(SENSE2-) ; also sheet 2
GND: R35.1 R36.1 R41.1 R42.1 U7.5(GND) U7.P$1(GND) U7.P$2(GND) U7.P$3(GND) U7.P$4(GND) U8.5(GND) U8.P$1(GND) U8.P$2(GND) U8.P$3(GND) U8.P$4(GND) U9.5(GND) U9.P$1(GND) U9.P$2(GND) U9.P$3(GND) U9.P$4(GND) U10.5(GND) U10.P$1(GND) U10.P$2(GND) U10.P$3(GND) U10.P$4(GND) ; also sheet 1,2,4
MCU_VCC [power]: R34.1 U8.4(SENSE2-) ; also sheet 1
N$9: R42.2 U10.6(ADDR_SEL)
N$11: R41.2 U9.6(ADDR_SEL)
N$12: R35.2 U7.6(ADDR_SEL)
N$14: R36.2 U8.6(ADDR_SEL)
SCL: R29.1 U7.9(SMCLK) U8.9(SMCLK) U9.9(SMCLK) U10.9(SMCLK) ; also sheet 1
SDA: R30.1 U7.8(SMDATA) U8.8(SMDATA) U9.8(SMDATA) U10.8(SMDATA) ; also sheet 1
SRAM_VDD_MON: R31.1 U7.2(SENSE1-) ; also sheet 2
USB_VCC_RAW [power]: R39.1 U9.4(SENSE2-) ; also sheet 1,4
WIRELESS_VCC [power]: R37.1 U9.2(SENSE1-) ; also sheet 1
Unconnected: U7.7(ALERT#) U8.7(ALERT#) U9.7(ALERT#) U10.7(ALERT#)

### Notes on the sheet
- Rmax = Vmax / Imax
  = 80mV / Imax
- Current measure
- FPGA_3V3 I/O and FPGA_1V8 I/O(and SRAM) | Daughter_Board and MCU
- Imax_SENSE1=100mA
  Imax_SENSE2=100mA
- Imax_SENSE1=100mA
  Imax_SENSE2=100mA
- FPGA_AUX and FPGA_Core | USB_VCC_ROW and Wireless board
- Imax_SENSE1=100mA
  Imax_SENSE2=100mA
- Imax_SENSE1=100mA
  Imax_SENSE2=533mA

## Sheet 4 of 4
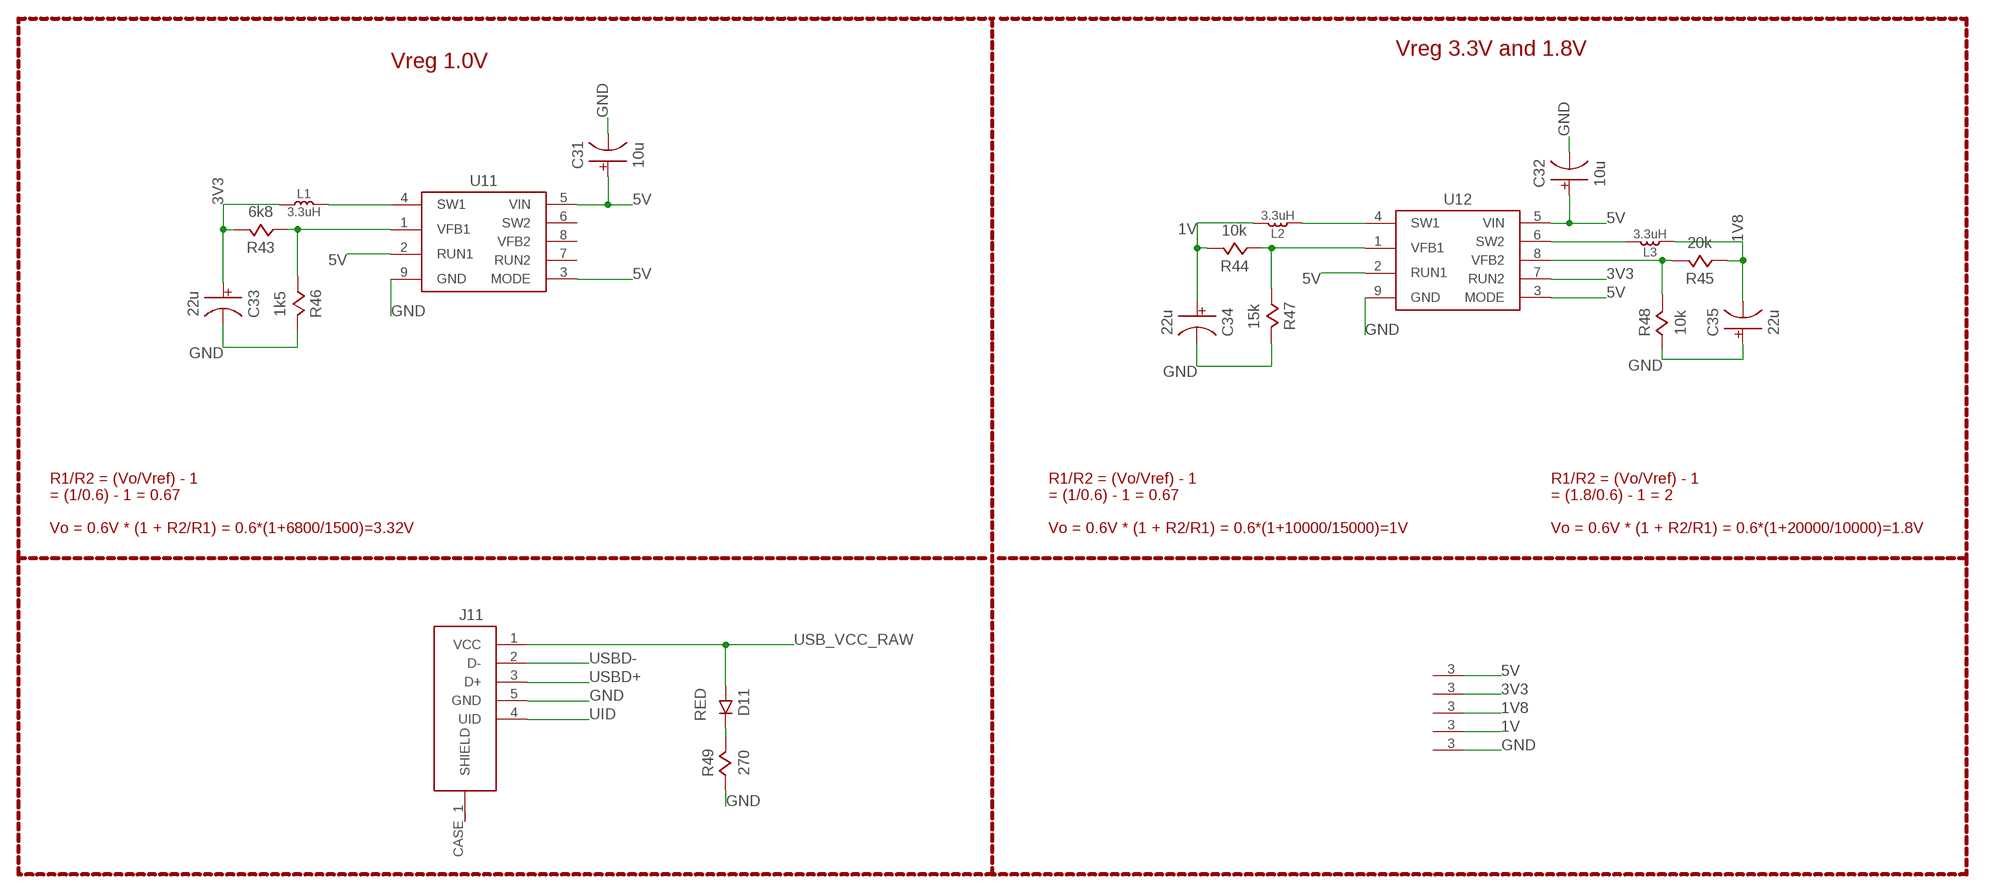
[diagram p4: schematic, sheet 4]

### Parts
C31  10u  CAPACITOR0805  [0805]
C32  10u  CAPACITOR0805  [0805]
C33  22u  CAPACITOR0805  [0805]
C34  22u  CAPACITOR0805  [0805]
C35  22u  CAPACITOR0805  [0805]
D11  RED  LED  [0805]
J11  USB_CONNMICRO_SMT  [USB_MICRO_B_SMT]
L1  3.3uH  INDUCTOR  [0805]
L2  3.3uH  INDUCTOR  [0805]
L3  3.3uH  INDUCTOR  [0805]
R43  6k8  RESISTOR  [0805]
R44  10k  RESISTOR  [0805]
R45  20k  RESISTOR  [0805]
R46  1k5  RESISTOR  [0805]
R47  15k  RESISTOR  [0805]
R48  10k  RESISTOR  [0805]
R49  270  RESISTOR  [0805]
TP1  TEST_POINTTHT  [THT]
TP2  TEST_POINTTHT  [THT]
TP3  TEST_POINTTHT  [THT]
TP4  TEST_POINTTHT  [THT]
TP5  TEST_POINTTHT  [THT]
U11  LTC3419DFN  [DFN8]
U12  LTC3419DFN  [DFN8]

### Nets
1V [power]: C34.1 L2.2 R44.2 TP4.3(>NAME) ; also sheet 3
1V8: C35.2 L3.1 R45.1 TP3.3(>NAME) ; also sheet 3
3V3 [power]: C33.1 L1.1 R43.2 TP2.3(>NAME) U12.7(RUN2) ; also sheet 1,2,3
5V [power]: C31.1 C32.1 TP1.3(>NAME) U11.2(RUN1) U11.3(MODE) U11.5(VIN) U12.2(RUN1) U12.3(MODE) U12.5(VIN) ; also sheet 1,3
GND: C31.2 C32.2 C33.2 C34.2 C35.1 J11.5(GND) R46.2 R47.2 R48.1 R49.1 TP5.3(>NAME) U11.9(GND) U12.9(GND) ; also sheet 1,2,3
N$2: R44.1 R47.1 U12.1(VFB1)
N$7: R45.2 R48.2 U12.8(VFB2)
N$22: L2.1 U12.4(SW1)
N$26: L3.2 U12.6(SW2)
N$28: D11.2 R49.2
N$53: R43.1 R46.1 U11.1(VFB1)
N$55: L1.2 U11.4(SW1)
UID: J11.4(UID) ; also sheet 1
USB_VCC_RAW [power]: D11.1 J11.1(VCC) ; also sheet 1,3
USBD+: J11.3(D+) ; also sheet 1
USBD-: J11.2(D-) ; also sheet 1
Unconnected: J11.CASE_1(SHIELD) U11.6(SW2) U11.7(RUN2) U11.8(VFB2)

### Notes on the sheet
- Vreg 3.3V and 1.8V
- Vreg 1.0V
- R1/R2 = (Vo/Vref) - 1
  = (1/0.6) - 1 = 0.67
  
  Vo = 0.6V * (1 + R2/R1) = 0.6*(1+6800/1500)=3.32V
- R1/R2 = (Vo/Vref) - 1
  = (1/0.6) - 1 = 0.67
  
  Vo = 0.6V * (1 + R2/R1) = 0.6*(1+10000/15000)=1V
- R1/R2 = (Vo/Vref) - 1
  = (1.8/0.6) - 1 = 2
  
  Vo = 0.6V * (1 + R2/R1) = 0.6*(1+20000/10000)=1.8V

## Library data of the parts
C1-C35 = passive:CAPACITOR
D1-D11 = opto:LED
J1 J2 = connectors:FEMALE_HEADER_5X2
J3 = connectors:ISP_CONN_6PIN; SPICEPREFIX: X
J4 = connectors:FEMALE_HEADER_2X1
J5 J7 = connectors:JUMPER
J6 = connectors:ISP_CONN_6PIN
J8 J11 = connectors:USB_CONN
J9 = connectors:JTAG_CONN_6PIN
J10 = connectors:FEMALE_HEADER_10X2
L1-L3 = passive:INDUCTOR
M1-M4 = power:SISS23DN
R1-R49 = passive:RESISTOR
S1 S3 = connectors:SPST_BUTTON
S2 = connectors:SPST_DIP_4
TP1-TP5 = connectors:TEST_POINT
U1 = ic:AT90USB128
U2 = wireless:MRF24J40MA
U3 = ic:ATMEGA32U4
U4 = ic:IS66WV51216EALL
U5 = fpga:SPARTAN7-LX15
U6 = ic:SST26VF032B
U7-U10 = sensors:PAC1720
U11 U12 = power:LTC3419
X1 X2 = passive:QUARTZ
X3-X5 = passive:OSCILLATOR